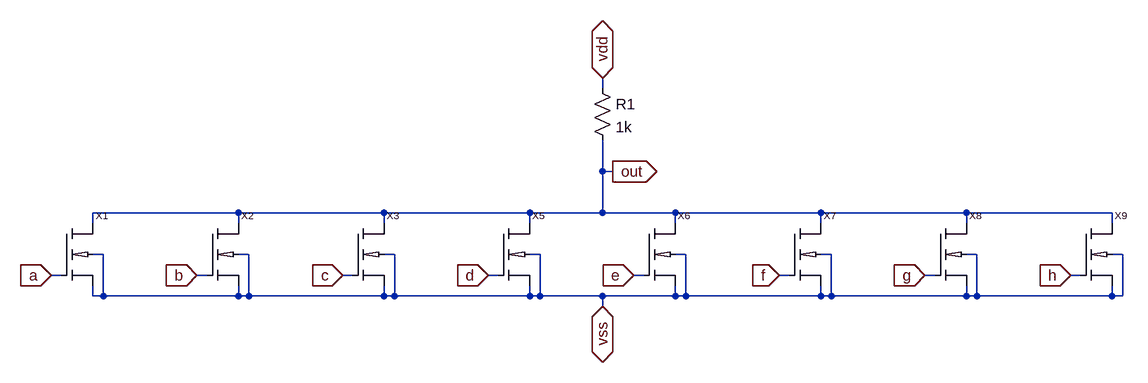
[diagram p0: schematic 8_way_nor.asc]
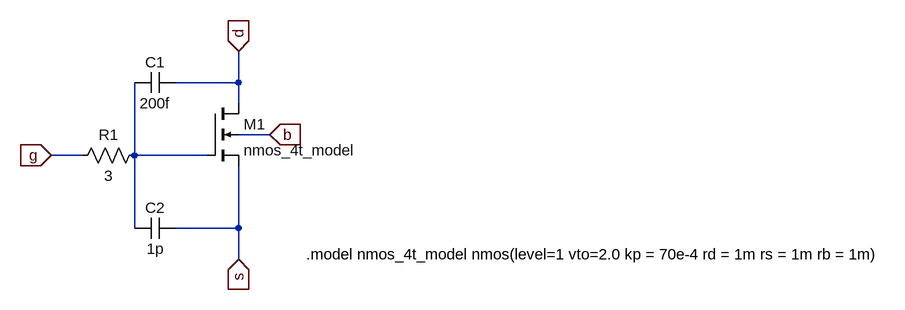
[diagram p1: sub-circuit nmos_4t.asc]
8_way_nor.asc, the LTspice schematic file:
Version 4
SHEET 1 1940 680
WIRE 1136 -96 1136 -112
WIRE 1136 32 1136 -16
WIRE 1152 32 1136 32
WIRE 576 96 352 96
WIRE 800 96 576 96
WIRE 1024 96 800 96
WIRE 1136 96 1136 32
WIRE 1136 96 1024 96
WIRE 1248 96 1136 96
WIRE 1472 96 1248 96
WIRE 1696 96 1472 96
WIRE 1920 96 1696 96
WIRE 352 112 352 96
WIRE 576 112 576 96
WIRE 800 112 800 96
WIRE 1024 112 1024 96
WIRE 1248 112 1248 96
WIRE 1472 112 1472 96
WIRE 1696 112 1696 96
WIRE 1920 112 1920 96
WIRE 368 160 352 160
WIRE 592 160 576 160
WIRE 816 160 800 160
WIRE 1040 160 1024 160
WIRE 1264 160 1248 160
WIRE 1488 160 1472 160
WIRE 1712 160 1696 160
WIRE 1936 160 1920 160
WIRE 304 192 288 192
WIRE 528 192 512 192
WIRE 752 192 736 192
WIRE 976 192 960 192
WIRE 1200 192 1184 192
WIRE 1424 192 1408 192
WIRE 1648 192 1632 192
WIRE 1872 192 1856 192
WIRE 352 224 352 208
WIRE 368 224 368 160
WIRE 368 224 352 224
WIRE 576 224 576 208
WIRE 576 224 368 224
WIRE 592 224 592 160
WIRE 592 224 576 224
WIRE 800 224 800 208
WIRE 800 224 592 224
WIRE 816 224 816 160
WIRE 816 224 800 224
WIRE 1024 224 1024 208
WIRE 1024 224 816 224
WIRE 1040 224 1040 160
WIRE 1040 224 1024 224
WIRE 1136 224 1040 224
WIRE 1248 224 1248 208
WIRE 1248 224 1136 224
WIRE 1264 224 1264 160
WIRE 1264 224 1248 224
WIRE 1472 224 1472 208
WIRE 1472 224 1264 224
WIRE 1488 224 1488 160
WIRE 1488 224 1472 224
WIRE 1696 224 1696 208
WIRE 1696 224 1488 224
WIRE 1712 224 1712 160
WIRE 1712 224 1696 224
WIRE 1920 224 1920 208
WIRE 1920 224 1712 224
WIRE 1936 224 1936 160
WIRE 1936 224 1920 224
WIRE 1136 240 1136 224
FLAG 1136 -112 vdd
IOPIN 1136 -112 BiDir
FLAG 1136 240 vss
IOPIN 1136 240 BiDir
FLAG 512 192 b
IOPIN 512 192 In
FLAG 288 192 a
IOPIN 288 192 In
FLAG 736 192 c
IOPIN 736 192 In
FLAG 1152 32 out
IOPIN 1152 32 Out
FLAG 960 192 d
IOPIN 960 192 In
FLAG 1184 192 e
IOPIN 1184 192 In
FLAG 1408 192 f
IOPIN 1408 192 In
FLAG 1632 192 g
IOPIN 1632 192 In
FLAG 1856 192 h
IOPIN 1856 192 In
SYMBOL res 1120 -112 R0
SYMATTR InstName R1
SYMATTR Value 1k
SYMBOL nmos_4t 304 112 R0
SYMATTR InstName X1
SYMBOL nmos_4t 528 112 R0
SYMATTR InstName X2
SYMBOL nmos_4t 752 112 R0
SYMATTR InstName X3
SYMBOL nmos_4t 976 112 R0
SYMATTR InstName X5
SYMBOL nmos_4t 1200 112 R0
SYMATTR InstName X6
SYMBOL nmos_4t 1424 112 R0
SYMATTR InstName X7
SYMBOL nmos_4t 1648 112 R0
SYMATTR InstName X8
SYMBOL nmos_4t 1872 112 R0
SYMATTR InstName X9

nmos_4t.asc, the sub-circuit schematic file:
Version 4
SHEET 1 880 680
WIRE -288 -224 -288 -272
WIRE -288 -224 -384 -224
WIRE -288 -192 -288 -224
WIRE -240 -144 -288 -144
WIRE -528 -112 -576 -112
WIRE -448 -112 -448 -224
WIRE -336 -112 -448 -112
WIRE -448 0 -448 -112
WIRE -288 0 -288 -96
WIRE -288 0 -384 0
WIRE -288 48 -288 0
FLAG -576 -112 g
IOPIN -576 -112 In
FLAG -288 -272 d
IOPIN -288 -272 In
FLAG -288 48 s
IOPIN -288 48 In
FLAG -240 -144 b
IOPIN -240 -144 In
SYMBOL nmos4 -336 -192 R0
SYMATTR InstName M1
SYMATTR Value nmos_4t_model
SYMBOL cap -384 -240 R90
WINDOW 0 0 32 VBottom 2
WINDOW 3 32 32 VTop 2
SYMATTR InstName C1
SYMATTR Value 200f
SYMBOL cap -384 -16 R90
WINDOW 0 0 32 VBottom 2
WINDOW 3 32 32 VTop 2
SYMATTR InstName C2
SYMATTR Value 1p
SYMBOL res -432 -128 R90
WINDOW 0 0 56 VBottom 2
WINDOW 3 32 56 VTop 2
SYMATTR InstName R1
SYMATTR Value 3
TEXT -184 40 Left 2 !.model nmos_4t_model nmos(level=1 vto=2.0 kp = 70e-4 rd = 1m rs = 1m rb = 1m)

The netlist it stands for:
* 8_way_nor.asc
R1 vdd out 1k
XX1 out a vss vss nmos_4t
XX2 out b vss vss nmos_4t
XX3 out c vss vss nmos_4t
XX5 out d vss vss nmos_4t
XX6 out e vss vss nmos_4t
XX7 out f vss vss nmos_4t
XX8 out g vss vss nmos_4t
XX9 out h vss vss nmos_4t

* block symbol definitions
.subckt nmos_4t D G S B
M1 d N001 s b nmos_4t_model
C1 d N001 200f
C2 s N001 1p
R1 N001 g 3
.model nmos_4t_model nmos(level=1 vto=2.0 kp = 70e-4 rd = 1m rs = 1m rb = 1m)
.ends nmos_4t

.model NMOS NMOS
.model PMOS PMOS
.lib standard.mos
.backanno
.end